# EAGLE design dCompass 7 (EAGLE 6.3)
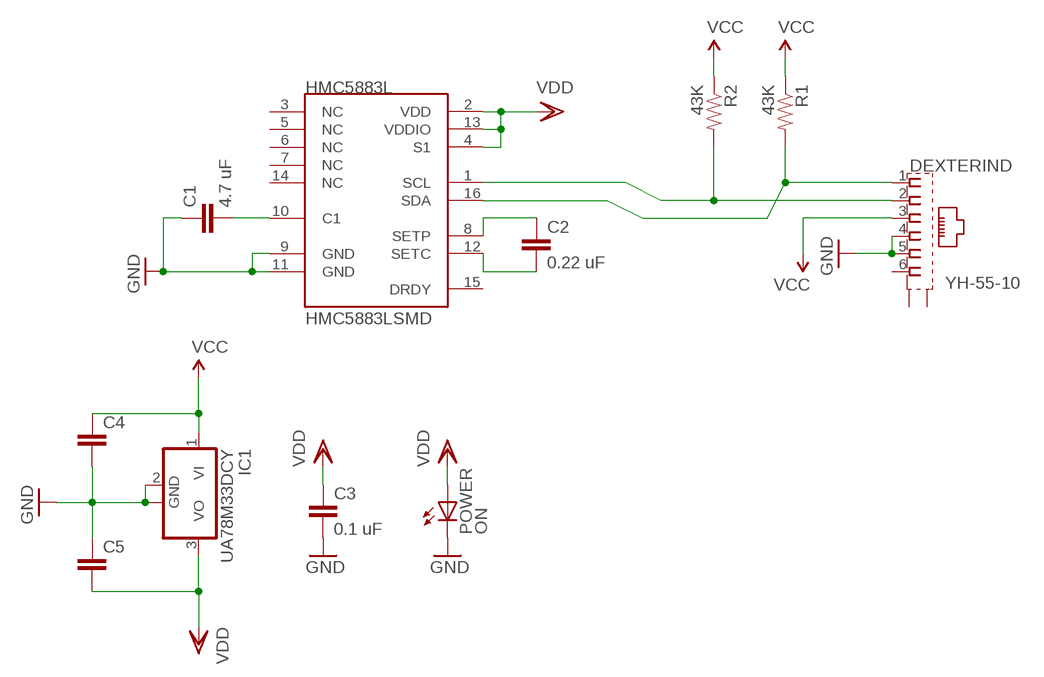
[diagram p0: schematic, sheet 1]

## Parts
C1  4.7 uF  CAP0805  [0805]
C2  0.22 uF  CAP0805  [0805]
C3  0.1 uF  CAP0805  [0805]
C4  CAP0805  [0805]
C5  CAP0805  [0805]
DEXTERIND  YH-55-10  [YH-55-10]
HMC5883L  HMC5883LSMD  [16LPCC]
IC1  UA78M33DCY  [SOT223]
POWER  ON  LED1206  [LED-1206]
R1  43K  RESISTOR0805-RES  [0805]
R2  43K  RESISTOR0805-RES  [0805]

## Nets
3V3: C3.1 C5.2 HMC5883L.2(VDD) HMC5883L.4(S1) HMC5883L.13(VDDIO) IC1.3(VO) POWER.A ; supply symbol labelled VDD
4V7: C4.1 DEXTERIND.3 IC1.1(VI) R1.1 R2.1 ; supply symbol labelled VCC
GND: C1.1 C3.2 C4.2 C5.1 DEXTERIND.4 DEXTERIND.5 HMC5883L.9(GND) HMC5883L.11(GND) IC1.2(GND) IC1.4(GND) POWER.C
N$5: C1.2 HMC5883L.10(C1)
N$6: C2.2 HMC5883L.12(SETC)
N$7: C2.1 HMC5883L.8(SETP)
SCL: DEXTERIND.2 HMC5883L.1(SCL) R2.2
SDA: DEXTERIND.1 HMC5883L.16(SDA) R1.2
Unconnected: DEXTERIND.6 DEXTERIND.S1(S) DEXTERIND.S2(S) HMC5883L.3(NC) HMC5883L.5(NC) HMC5883L.6(NC) HMC5883L.7(NC) HMC5883L.14(NC) HMC5883L.15(DRDY)

## Library data of the parts
C1-C5 = SparkFun:CAP: Capacitor Standard 0603 ceramic capacitor, and 0.1" leaded capacitor.
DEXTERIND = con-wenzhou-yihua:YH-55-10: RJ11 6 connects Source: YH-55-10.pdf; OC_FARNELL: unknown; OC_NEWARK: unknown
HMC5883L = SparkFun-f115009:HMC5883L: 3 Axis Digital Compass IC
IC1 = linear:UA78M*: POSITIVE-VOLTAGE REGULATORS Source: http://focus.ti.com/lit/ds/symlink/ua78m33.pdf
POWER = SparkFun-f115009:LED: LEDs Standard schematic elements and footprints for 5mm, 3mm, 1206, and 0603 sized LEDs. 5mm - Spark Fun Electronics SKU : COM-00529 (and others)
R1 R2 = SparkFun:RESISTOR: Resistor Basic schematic elements and footprints for 0603, 1206, and PTH resistors.

## Net classes
1 One: width 0.127 mm, drill 0.127 mm

## Board
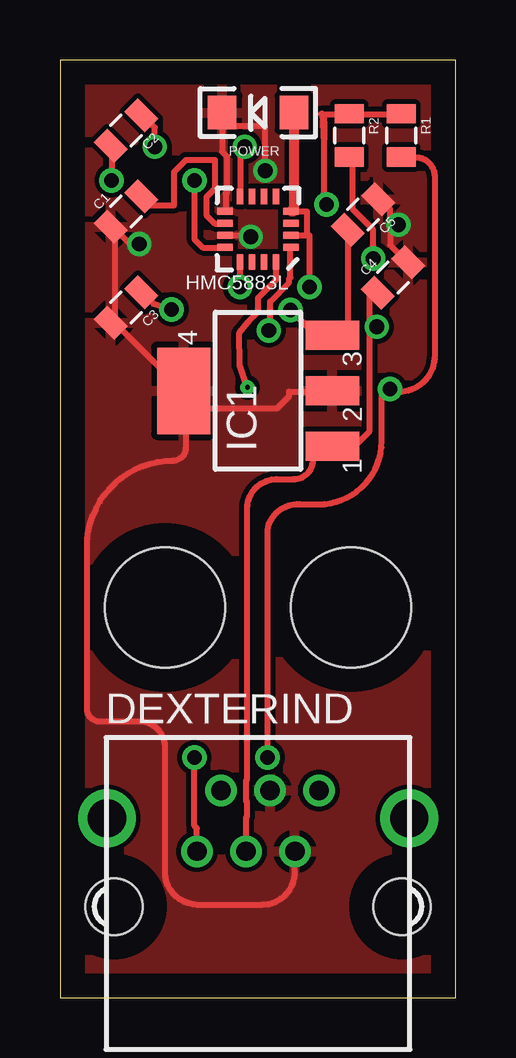
[diagram p1: board, top side]
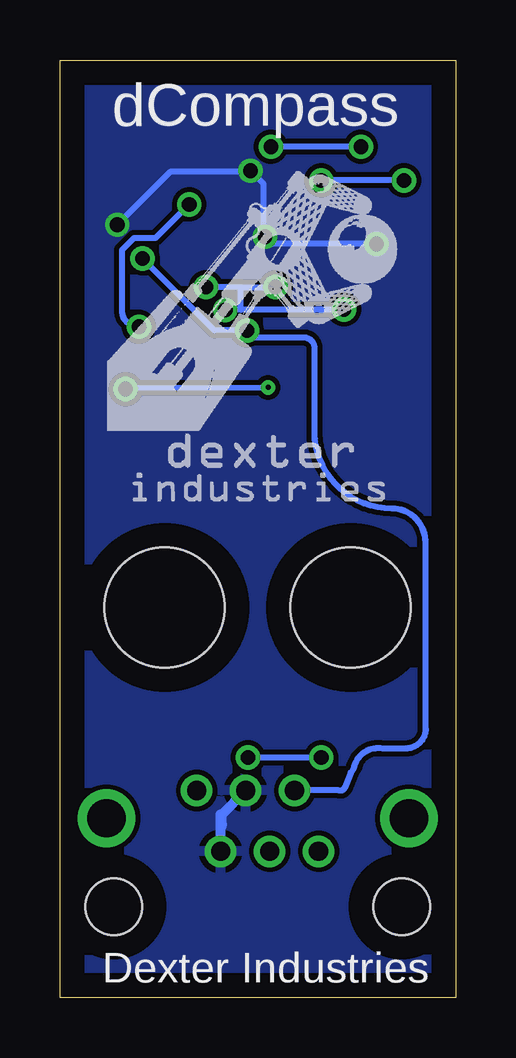
[diagram p2: board, bottom side, seen from below]

Size 16.48 x 39.06 mm. Coordinates in mm from the lower left corner, seen from the top.
Outline: 0,0 16.48,0 16.48,39.06 0,39.06 0,0
Copper layers (1*16): Top 0.035mm / dielectric 1.5mm / Bottom 0.035mm
Design rules "default *": minimum track width 10mil, minimum drill 24mil, track to track 8mil, track to pad 8mil, pad to pad 8mil, via to via 8mil, smd to smd 8mil, copper to edge 40mil, drill to drill 8mil, minimum pad ring 10mil, minimum via ring 8mil, stop-mask expansion 4mil, vias tented up to drill 24mil, thermal gap 10mil
Holes 5 mm at 4.38,16.25 12.12,16.25

### Footprints (pad centres in the part's own frame; a part is rotated, then mirrored left to right if it is on the bottom)
0805 = smd 0.8 x 1.2: 1 -0.9,0; 2 0.9,0
YH-55-10 = drill 0.8 pad 1.3: 1 -2.54,2.3; 2 -1.54,4.84; 3 -0.5,2.3; 4 0.5,4.84; 5 1.54,2.3; 6 2.54,4.84 | drill 1.6 pad 2.184: S1 -6.3,3.68; S2 6.3,3.68 | hole 2.36: -6,0; 6,0
16LPCC = smd 0.65 x 0.28: 1 -1.37,0.75; 2 -1.37,0.25; 3 -1.37,-0.25; 4 -1.37,-0.75; 9 1.37,-0.75; 10 1.37,-0.25; 11 1.37,0.25; 12 1.37,0.75 | smd 0.28 x 0.65: 5 -0.75,-1.37; 6 -0.25,-1.37; 7 0.25,-1.37; 8 0.75,-1.37; 13 0.75,1.37; 14 0.25,1.37; 15 -0.25,1.37; 16 -0.75,1.37
SOT223 = smd 1.219 x 2.235: 1 -2.311,-3.099; 2 0,-3.099; 3 2.311,-3.099 | smd 3.6 x 2.2: 4 0,3.099
LED-1206 = smd 1.2 x 1.4: A -1.5,0; C 1.5,0

### Placement (x,y rotation side)
C1  2.75,32.75 45 top
C2  2.75,36.12 225 top
C3  2.75,28.75 225 top
C4  13.88,30 45 top
C5  12.62,32.62 225 top
DEXTERIND  8.25,3.79 0 top
HMC5883L  8.25,32.02 180 top
IC1  8.25,25.28 90 top
POWER  8.25,36.87 180 top
R1  14.22,35.92 270 top
R2  12.05,35.92 270 top

### Tracks (layer width: path | path; a pad name or v marks a point on that pad's centre or on a via)
3V3  (via drill 0.61)
  Top 0.254: v4.65,28.68 3.9,28.9 3.45,29.35 3.4,29.35 C3.1 | v9.6,28.65 10.35,27.9 10.35,27.65 10.4,27.6 11.3,27.6 IC1.3 11.45,27.6 12,27.6 12,31.95 C5.2 | 10.3,31.8 10.3,32.75 9.65,32.75 HMC5883L.4 | 10.3,31.8 10.25,31.75 9.65,31.75 HMC5883L.2 | v10.4,29.6 10.4,31.75 10.3,31.8 | v7.5,29.6 HMC5883L.13
  Top 0.406: HMC5883L.4 9.75,32.77 POWER.A
  Bottom 0.254: v4.65,28.68 4.5,28.65 8.95,28.65 | 8.95,28.65 v9.6,28.65 | 8.95,29.6 v7.5,29.6 | 8.95,29.6 v10.4,29.6 | 8.95,28.65 8.95,29.6
4V7  (via drill 0.61)
  Top 0.254: R1.1 14.2,36.8 12.05,36.8 R2.1 11.95,36.8 11.1,36.8 11,36.7 11,36.45 | 10.95,36.83 11,36.38 | 11,36.38 11,35.75 | 11,36.38 11,36.45 | 12.9,27.95 12.9,23.6 12.25,22.95 11.35,22.95 IC1.1 11.25,22.95 10.6,22.95 10.55,22.9 10.55,22.41 arc-90 9.74,21.6 9.03,21.6 arc90 7.8,20.37 7.8,9.1 7.75,9.05 7.75,8.2 7.8,8.15 7.8,7.55 7.75,7.5 DEXTERIND.3 | 12.9,27.95 12.9,29.6 12.95,29.6 13.15,29.4 13.2,29.4 C4.1 | v11.1,33.05 11,33.15 11,35.6 10.95,36.83 | 12.9,27.95 v13.2,27.95 | 10.95,36.83 10.88,36.83 | 10.95,36.83 11,36.45
  Bottom 0.254: v11.1,33.05 12.5,31.65 13.4,31.65 13.9,31.15 13.9,28.62 arc-90 13.22,27.95 v13.2,27.95
GND  (via drill 0.61)
  Top 0.254: HMC5883L.9 6.9,32.8 6.9,33.5 6.95,33.55 6.95,35.05 6.75,35.25 POWER.C 6.85,36.3 8.55,36.3 v8.55,34.45 | v7.95,31.7 7.9,31.75 6.9,31.75 HMC5883L.11 | v3.3,31.4 2.9,31.4 2.15,32.15 C1.1 2.3,31.85 2.3,28.15 C3.2 2.35,28.05 5.05,25.35 IC1.4 5.2,25.25 5.2,24.55 5.25,24.55 | 13.75,32.2 13.75,31.35 14.5,30.6 C4.2 | 13.75,32.2 13.75,32.85 13.35,33.25 13.3,33.25 C5.1 | v14.1,32.2 13.75,32.2 | IC1.2 11.3,25.25 9.55,25.25 9.55,25.05 9.05,24.55 5.25,24.55 | 5.25,24.55 5.25,22.91 arc-90 4.72,22.38 arc90 1.12,18.78 1.12,12.03 arc90 1.66,11.5 3.25,11.5 arc-90 4.38,10.5 4.38,5.3 arc90 5.67,3.88 8.43,3.88 arc90 9.79,5.23 DEXTERIND.5
  Bottom 0.254: v3.3,31.4 7.65,31.4 v7.95,31.7 8,31.8 8,33.9 v8.55,34.45 8.65,34.4 11.9,34.4 v14.1,32.2
  Bottom 0.406: DEXTERIND.4 9.75,7.62 9.75,7.13 9.79,7.63 DEXTERIND.5
  pour Bottom: 0.3,38.84 16.03,38.84 16.03,0.38 0.46,0.38 0.46,38.68
  pour Top: 0.3,39.01 16.18,39.01 16.18,0.38 0.23,0.38 0.23,38.86
N$5
  Top 0.254: C1.2 3.4,33.35 3.45,33.35 3.8,33 4.75,33 4.75,34.4 5.25,34.9 6.45,34.9 6.45,33.7 6.1,33.35 6.1,32.6 6.45,32.25 6.85,32.25 HMC5883L.10
N$6  (via drill 0.61)
  Top 0.254: v2.15,34.05 2.15,35.45 C2.2 | v5.6,34.05 5.6,31.6 5.95,31.25 6.85,31.25 HMC5883L.12
  Bottom 0.254: v2.15,34.05 v5.6,34.05
N$7  (via drill 0.61)
  Top 0.254: v3.95,35.45 3.95,36.25 3.45,36.75 C2.1 | v7.7,35.45 7.5,35.25 HMC5883L.8
  Bottom 0.254: v3.95,35.45 v7.7,35.45
SCL  (via drill 0.61)
  Top 0.254: v13.05,30.8 13.05,32 12.2,32.85 12.2,35 12.05,35 R2.2 | v8.7,27.8 8.75,27.85 8.75,29 9.55,29.8 9.55,29.95 9.6,30 9.6,31.25 HMC5883L.1
  Bottom 0.254: v13.05,30.8 10.05,27.8 v8.7,27.8 8.7,27.5 6.33,27.5 arc90 5.88,27.05 5.88,23.59 arc-90 2.66,20.38 arc90 1.25,18.96 1.25,11.21 arc90 2.09,10.38 3.05,10.38 arc-90 4.25,9.55 4.38,9.38 4.62,8.75 arc90 4.87,8.63 DEXTERIND.2
SDA  (via drill 0.2, 0.61)
  Top 0.254: v5.6,10 5.6,7.15 5.7,7.05 DEXTERIND.1 | R1.2 14.25,35 14.82,35 arc-90 15.62,34.2 15.62,26.75 arc-90 14.12,25.25 14.12,25.35 v13.75,25.35 13.4,25 13.4,23.17 arc-90 10.78,20.55 10.1,20.55 arc90 8.65,19.48 v8.65,10 | v7.81,25.43 7.48,26.35 7.47,27.7 7.85,28.15 8.25,28.55 8.25,29.15 9,29.9 HMC5883L.16
  Bottom 0.254: v5.6,10 v8.65,10 | v7.81,25.43 13.65,25.4 v13.75,25.35

### Text on the board
bNames: dCompass | Dexter Industries